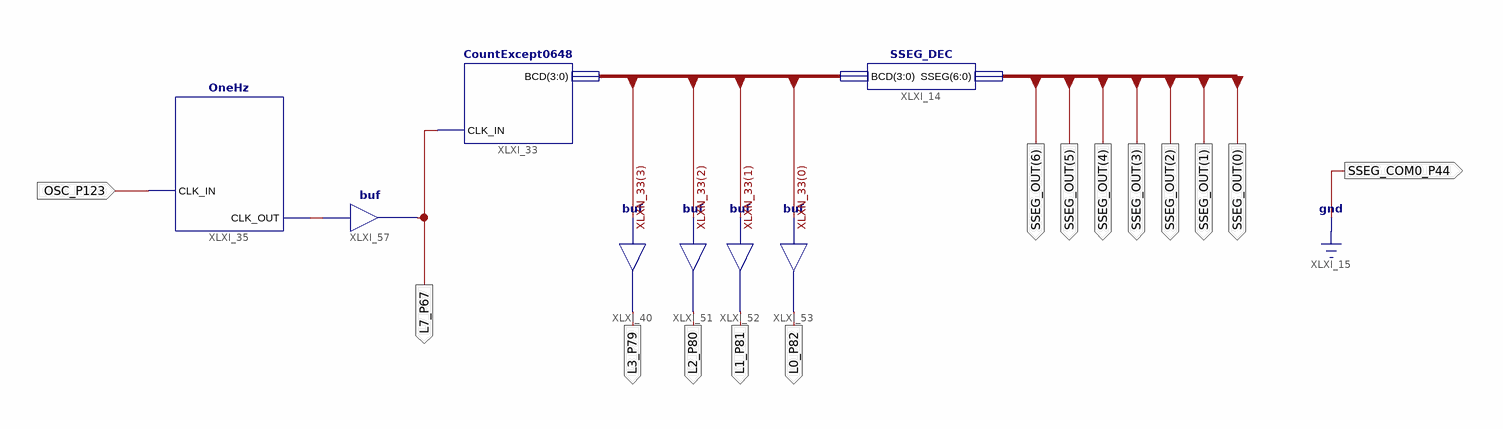
[diagram p0: schematic sheet 1]
// Xilinx ISE schematic main.sch (spartan6) as structural Verilog: 8 symbols, 14 ports
module main (
  input  OSC_P123,
  output SSEG_COM0_P44,
  output L7_P67,
  output [6:0] SSEG_OUT,
  output L2_P80,
  output L1_P81,
  output L0_P82,
  output L3_P79
);

  wire XLXN_37;
  wire [3:0] XLXN_33;

  OneHz XLXI_35 (.CLK_IN(OSC_P123), .CLK_OUT(XLXN_37));
  CountExcept0648 XLXI_33 (.CLK_IN(L7_P67), .BCD(XLXN_33));
  SSEG_DEC XLXI_14 (.BCD(XLXN_33), .SSEG(SSEG_OUT));
  buf XLXI_51 (L2_P80, XLXN_33[2]);
  buf XLXI_52 (L1_P81, XLXN_33[1]);
  buf XLXI_53 (L0_P82, XLXN_33[0]);
  buf XLXI_40 (L3_P79, XLXN_33[3]);
  buf XLXI_57 (L7_P67, XLXN_37);

  assign SSEG_COM0_P44 = 1'b0;
endmodule
